# Altium schematic sheet 4_5VLDO.SchDoc
size A4
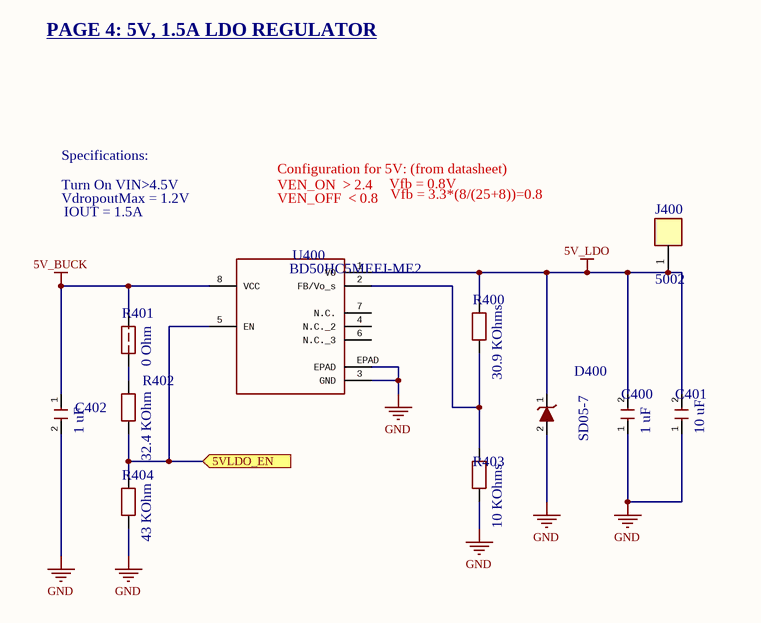
[diagram p0: 4_5VLDO.SchDoc]

## Parts
C400  value 1 uF  [CAP_0603]  (hidden comment: GCM188R71C105KA64)
C401  value 10 uF  [CAP_0603]  (hidden comment: GRM188R61E106KA73D)
C402  value 1 uF  [CAP_0603]  (hidden comment: GRT188R61H105KE13D)
D400  SD05-7  [DIODE_DO-214AC]
J400  5002  [KEYSTONE_5002]
R400  value 30.9 KOhms  [RES_0603]  (hidden comment: ERJ6ENF3092V)
R401  value 0 Ohm  [RES_0603]  (hidden comment: ERJ3GEY0R00V)
R402  value 32.4 KOhm  [RES_0603]  (hidden comment: RC0603FR-0732K4L)
R403  value 10 KOhms  [RES_0603]  (hidden comment: ERJ3GEYJ103V)
R404  value 43 KOhm  [RES_0603]  (hidden comment: ERJ3GEYJ433V)
U400  BD50HC5MEFJ-ME2  [REG_SOP8_SOIC8_EPAD]

## Ports
5VLDO_EN (in)

## Nets
5V_BUCK: C402.1 R401.2 U400.8(VCC)
5V_LDO: C400.2 C401.2 D400.1 J400.1 R400.2 U400.1(VO)
GND: C400.1 C401.1 C402.2 D400.2 R403.1 R404.1 U400.3(GND) U400.EPAD
5VLDO_EN: R402.2 R404.2 U400.5(EN) ; port 5VLDO_EN
NetR400_1: R400.1 R403.2 U400.2(FB/Vo_s)
NetR401_1: R401.1 R402.1

Not connected (* = marked no-connect by the designer): U400 4(N.C._2) 6(N.C._3) 7(N.C.)

## Notes on the sheet
- PAGE 4: 5V, 1.5A LDO REGULATOR
- Specifications:
- Configuration for 5V: (from datasheet)
- Turn On VIN>4.5V
- VdropoutMax = 1.2V
- IOUT = 1.5A
- VEN_ON  > 2.4
- VEN_OFF  < 0.8
- Vfb = 0.8V
- Vfb = 3.3*(8/(25+8))=0.8

## Library data of the parts
C400 = GCM188R71C105KA64D: Cap Ceramic 1uF 16V 0603; Manufacturer_Name: Murata Electronics; GateName_1: G$1; SymbolName_1: GCM188R71C105KA64D; LibraryName: GCM188R71C105KA64D; DeviceSetName: GCM188R71C105KA64D; Manufacturer_Part_Number: GCM188R71C105KA64D; Mouser_Part_Number: 81-GCM188R71C105K64D; Mouser_Price-Stock: https://www.mouser.co.uk/ProductDetail/Murata-Electronics/GCM188R71C105KA64D?qs=bQrJpfqjX%252BKtVgLYIBGvIg%3D%3D; Arrow_Part_Number: GCM188R71C105KA64D; Arrow_Price-Stock: https://www.arrow.com/en/products/gcm188r71c105ka64d/murata-manufacturing?region=nac; Height: 0.9mm; Link: https://www.digikey.ca/en/products/detail/murata-electronics/GCM188R71C105KA64D/1979250; Package: 0603; PartNumber: GCM188R71C105KA64; SupplierPartNumber: 490-5241-2-ND; SuppliersPartNumber: C161212
C401 = GRM188R61E106KA73D: Cap Ceramic 10uF 35V 0603; Manufacturer_Name: Murata Electronics; Link: https://www.digikey.ca/en/products/detail/murata-electronics/GRM188R61E106KA73D/9867922?s=N4IgTCBcDaIOICUCyBGAHGhA2FBRFADFgNICCA7AMwAiIAugL5A; Package: 0603; PartNumber: GRM188R61E106KA73D; SupplierPartNumber: 490-18214-2-ND; SuppliersPartNumber: C344022
C402 = GRT188R61H105KE13D: Cap Ceramic 1uF 50V 0603; Manufacturer: Murata Electronics; PartNumber: GCM188R71C105KA64; Link: https://www.digikey.ca/en/products/detail/murata-electronics/GRT188R61H105KE13D/5416752?s=N4IgTCBcDaIOICUAqBGAHGhA2FAJFADAKwDSAoigMwAiIAugL5A; Package: 0603; SupplierPartNumber: 490-12330-2-ND; SuppliersPartNumber: C126631
D400 = SD05-7: Diode TVS 5V; Mfr_Name: Diodes Inc; Value: TVS 5V; Link: https://www.digikey.ca/en/products/detail/diodes-incorporated/SD05-7/2052792; Package: SOD-323; PartNumber: SD05-7; SupplierPartNumber: SD05DITR-ND; SuppliersPartNumber: C460454
J400 = 5002: Test Point Ring Keystone; Manufacturer: Keystone Electronics; Value: Test Point Keystone Electronics; Package: *; PartNumber: 5002; SupplierNumber: 36-5002-ND; SuppliersPartNumber: C238123; Link: https://www.digikey.ca/en/products/detail/keystone-electronics/5002/255328
R400 = ERJ6ENF3092V: Res 30.9KOhms 1/8W 0603; Link: https://www.digikey.ca/en/products/detail/panasonic-electronic-components/ERJ-6ENF3092V/111570?s=N4IgTCBcDaIKICUBSA2OA5AYgZgAwE4wA1EAXQF8g; Package: 0603; PartNumber: ERJ6ENF3092V; SupplierPartNumber: P30.9KCTR-ND; SuppliersPartNumber: C416839
R401 = ERJ3GEY0R00V: Res 0Ohm 1/10W 0603; Link: https://www.digikey.ca/en/products/detail/panasonic-electronic-components/ERJ-3GEY0R00V/135656?s=N4IgTCBcDaIKICUBSBmA4nAmgBgd7AaiALoC%2BQA; Package: 0603; SupplierPartNumber: P0.0GTR-ND; SuppliersPartNumber: C122704; PartNumber: ERJ3GEY0R00V
R402 = RC0603FR-0732K4L: Res 32.4KOhm 1/10W 0603; Link: https://www.digikey.ca/en/products/detail/RC0603FR-0732K4L/311-32.4KHRCT-ND/730102?curr=cad&utm_campaign=buynow&utm_medium=aggregator&utm_source=octopart; Package: 0603; PartNumber: RC0603FR-0732K4L; SupplierPartNumber: 311-32.4KHRCT-ND; SuppliersPartNumber: C309561
R403 = ERJ3GEYJ103V: Res 10KOhms 1/10W 0603; Link: https://www.mouser.ca/ProductDetail/Panasonic/ERJ-3GEYJ103V?qs=66DK8nO8gJBWgc%252B0VNNxzg%3D%3D; Package: 0603; PartNumber: ERJ3GEYJ103V; SupplierPartNumber: 667-ERJ-3GEYJ103V; SuppliersPartNumber: C169849
R404 = ERJ3GEYJ433V: Res 43KOhm 1/10W 0603; Manufacturer_Name: Panasonic; Height: 0.55mm; Link: https://www.digikey.ca/en/products/detail/panasonic-electronic-components/ERJ-3GEYJ433V/104624; Package: 0603; PartNumber: ERJ3GEYJ433V; SupplierPartNumber: P43KGTR-ND; SuppliersPartNumber: C403499
U400 = BD50HC5MEFJ-ME2: LDO 8Vin 5Vout 1.5A; Manufacturer: ROHM Semiconductor; Value: LDO 5V; PartNumber: BD50HC5MEFJ-ME2; SupplierNumber: BD50HC5MEFJ-ME2TR-ND; SuppliersPartNumber: *; Package: 8-SOIC